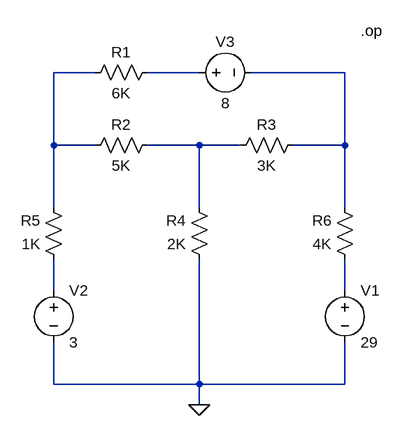
[diagram p0: schematic guia_1A_ej_20.asc]
guia_1A_ej_20.asc, the LTspice schematic file:
Version 4
SHEET 1 880 680
WIRE 208 128 144 128
WIRE 368 128 288 128
WIRE 592 128 448 128
WIRE 144 240 144 128
WIRE 208 240 144 240
WIRE 368 240 288 240
WIRE 432 240 368 240
WIRE 592 240 592 128
WIRE 592 240 512 240
WIRE 144 336 144 240
WIRE 368 336 368 240
WIRE 592 336 592 240
WIRE 144 464 144 416
WIRE 592 464 592 416
WIRE 144 608 144 544
WIRE 368 608 368 416
WIRE 368 608 144 608
WIRE 592 608 592 544
WIRE 592 608 368 608
WIRE 368 640 368 608
FLAG 368 640 0
SYMBOL res 304 112 R90
WINDOW 0 0 56 VBottom 2
WINDOW 3 32 56 VTop 2
SYMATTR InstName R1
SYMATTR Value 6K
SYMBOL res 304 224 R90
WINDOW 0 0 56 VBottom 2
WINDOW 3 32 56 VTop 2
SYMATTR InstName R2
SYMATTR Value 5K
SYMBOL res 528 224 R90
WINDOW 0 0 56 VBottom 2
WINDOW 3 32 56 VTop 2
SYMATTR InstName R3
SYMATTR Value 3K
SYMBOL res 384 432 R180
WINDOW 0 36 76 Left 2
WINDOW 3 36 40 Left 2
SYMATTR InstName R4
SYMATTR Value 2K
SYMBOL res 160 432 R180
WINDOW 0 36 76 Left 2
WINDOW 3 36 40 Left 2
SYMATTR InstName R5
SYMATTR Value 1K
SYMBOL res 608 432 R180
WINDOW 0 36 76 Left 2
WINDOW 3 36 40 Left 2
SYMATTR InstName R6
SYMATTR Value 4K
SYMBOL voltage 592 448 R0
SYMATTR InstName V1
SYMATTR Value 29
SYMBOL voltage 144 448 R0
SYMATTR InstName V2
SYMATTR Value 3
SYMBOL voltage 352 128 R270
WINDOW 0 32 56 VTop 2
WINDOW 3 -32 56 VBottom 2
SYMATTR InstName V3
SYMATTR Value 8
TEXT 616 64 Left 2 !.op

The netlist it stands for:
* guia_1A_ej_20.asc
R1 N002 N001 6K
R2 N004 N001 5K
R3 N003 N004 3K
R4 0 N004 2K
R5 N005 N001 1K
R6 N006 N003 4K
V1 N006 0 29
V2 N005 0 3
V3 N002 N003 8
.op
.backanno
.end